# Altium schematic sheet PFC.SchDoc
size 420 x 297 mm
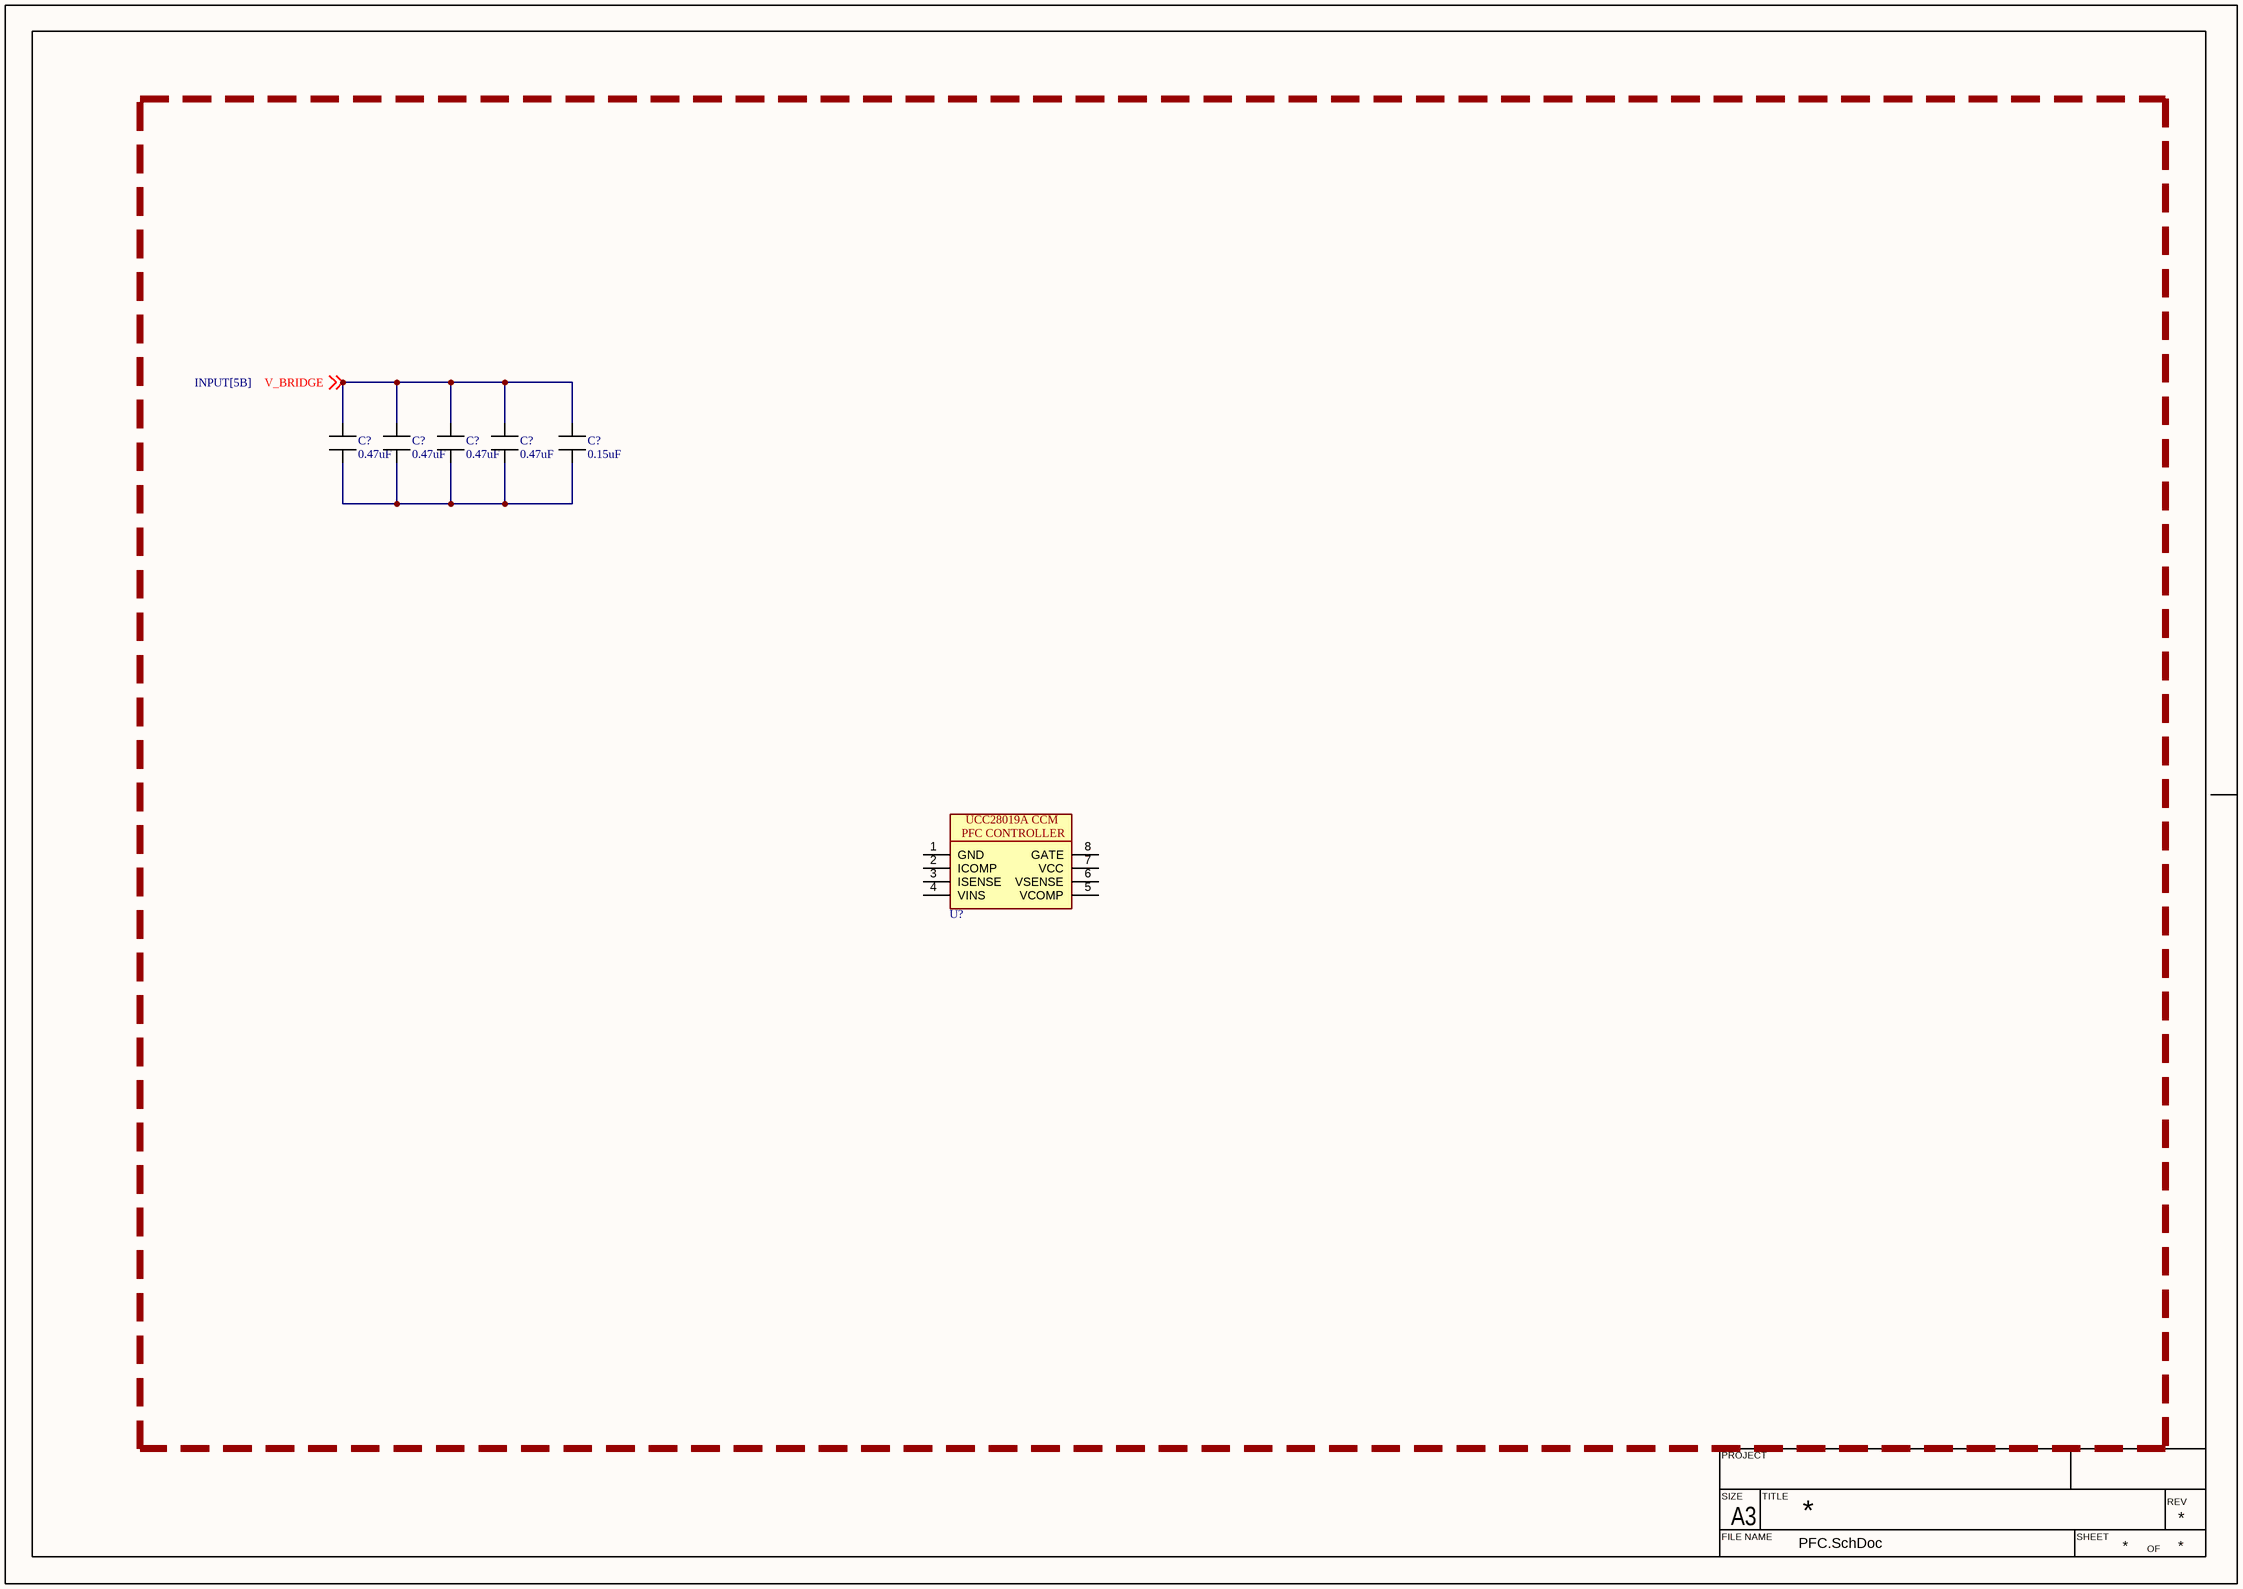
[diagram p0: PFC.SchDoc]

## Parts
(Parts that share a designator on the sheet are numbered #1, #2 ... from top to bottom, then left to right.)
C?#1  value 0.47uF  [B32922C3474M000]  (hidden comment: B3292-X2)
C?#2  value 0.47uF  [B32922C3474M000]  (hidden comment: B3292-X2)
C?#3  value 0.47uF  [B32922C3474M000]  (hidden comment: B3292-X2)
C?#4  value 0.47uF  [B32922C3474M000]  (hidden comment: B3292-X2)
C?#5  value 0.15uF  [B32922C3474M000]  (hidden comment: B3292-X2)
U?  UCC28019AD  [SOIC127P600X175-8N]  (value not drawn)

## Nets
V_BRIDGE: C?#1.2 C?#2.2 C?#3.2 C?#4.2 C?#5.2 ; off-sheet V_BRIDGE
NetC?#1_1: C?#1.1 C?#2.1 C?#3.1 C?#4.1 C?#5.1

Not connected (* = marked no-connect by the designer): U? 1(GND) 2(ICOMP) 3(ISENSE) 4(VINS) 5(VCOMP) 6(VSENSE) 7(VCC) 8(GATE)

## Notes on the sheet
- PROJECT
- SIZE
- FILE NAME
- A3
- TITLE
- SHEET
- OF
- REV
- (in symbol UCC28019AD) UCC28019A CCM; PFC CONTROLLER

## Library data of the parts
C?#1-C?#4 = B3292-X2: Film Capacitor Polypropylene (PP); Manufacturer 1: *; Manufacturer Part Number 1: B32922C3474M000
C?#5 = B3292-X2: Film Capacitor Polypropylene (PP); Manufacturer Part Number 1: B32922C3154M000; Manufacturer 1: *
U? = UCC28019AD: Manufacturer 1: *; Manufacturer Part Number 1: *; Value: *